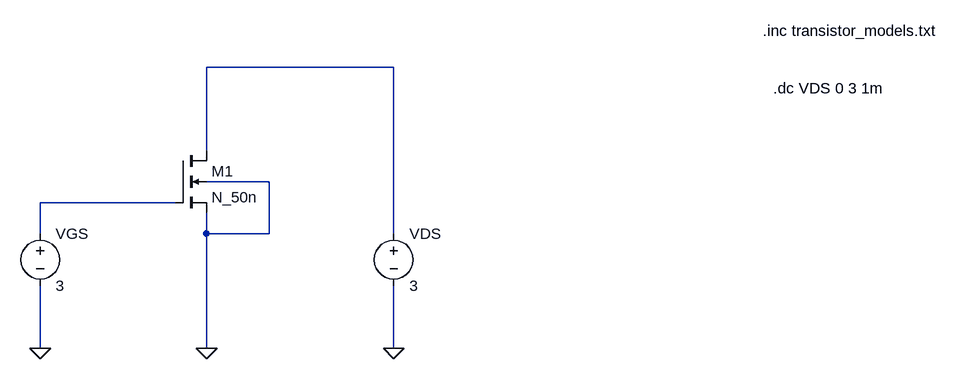
[diagram p0: schematic lab01_nmos2u_characterization.asc]
lab01_nmos2u_characterization.asc, the LTspice schematic file:
Version 4
SHEET 1 1272 808
WIRE 368 96 80 96
WIRE 80 224 80 96
WIRE 176 272 80 272
WIRE 32 304 -176 304
WIRE -176 352 -176 304
WIRE 80 352 80 320
WIRE 176 352 176 272
WIRE 176 352 80 352
WIRE 368 352 368 96
WIRE -176 528 -176 432
WIRE 80 528 80 352
WIRE 368 528 368 432
FLAG 80 528 0
FLAG -176 528 0
FLAG 368 528 0
SYMBOL nmos4 32 224 R0
SYMATTR InstName M1
SYMATTR Value N_50n
SYMATTR Value2 l=1u w=10u
SYMBOL voltage 368 336 R0
WINDOW 123 0 0 Left 0
WINDOW 39 0 0 Left 0
SYMATTR InstName VDS
SYMATTR Value 3
SYMBOL voltage -176 336 R0
WINDOW 123 0 0 Left 0
WINDOW 39 0 0 Left 0
SYMATTR InstName VGS
SYMATTR Value 3
TEXT 936 40 Left 2 !.inc transistor_models.txt
TEXT 952 128 Left 2 !.dc VDS 0 3 1m

The netlist it stands for:
* lab01_nmos2u_characterization.asc
M1 N001 N002 0 0 N_50n l=1u w=10u
VDS N001 0 3
VGS N002 0 3
.model NMOS NMOS
.model PMOS PMOS
.lib standard.mos
.inc transistor_models.txt
.dc VDS 0 3 1m
.backanno
.end